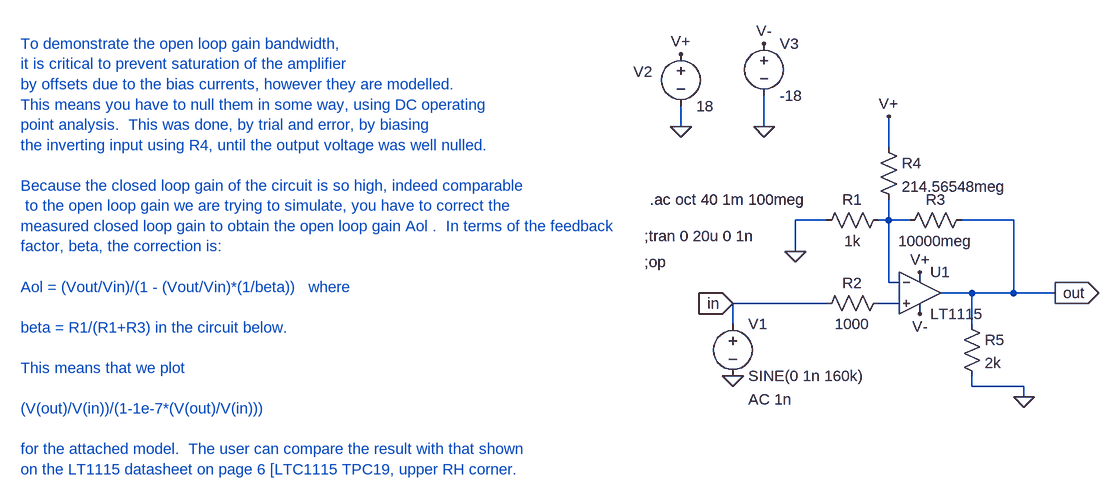
[diagram p0: schematic LT1115 Aol Demonstrator.asc]
LT1115 Aol Demonstrator.asc, the LTspice schematic file:
Version 4
SHEET 1 880 680
WIRE -192 32 -192 0
WIRE -112 336 -112 304
WIRE -64 32 -64 -16
WIRE -16 224 -16 176
WIRE 32 176 -16 176
WIRE 32 304 -112 304
WIRE 128 64 128 16
WIRE 128 176 112 176
WIRE 128 176 128 144
WIRE 128 272 128 176
WIRE 144 272 128 272
WIRE 144 304 112 304
WIRE 160 176 128 176
WIRE 256 288 208 288
WIRE 256 336 256 288
WIRE 256 432 256 416
WIRE 320 176 240 176
WIRE 320 288 256 288
WIRE 320 288 320 176
WIRE 336 432 256 432
WIRE 336 448 336 432
WIRE 384 288 320 288
FLAG -192 32 0
FLAG -64 32 0
FLAG -112 416 0
FLAG -192 -80 V+
FLAG -64 -96 V-
FLAG 384 288 out
IOPIN 384 288 Out
FLAG -112 304 in
IOPIN -112 304 In
FLAG -16 224 0
FLAG 176 256 V+
FLAG 176 320 V-
FLAG 128 16 V+
FLAG 336 448 0
SYMBOL voltage -112 320 R0
WINDOW 123 24 132 Left 0
WINDOW 39 0 0 Left 0
SYMATTR Value2 AC 1n
SYMATTR InstName V1
SYMATTR Value SINE(0 1n 160k)
SYMBOL voltage -192 -96 R0
WINDOW 123 0 0 Left 0
WINDOW 39 0 0 Left 0
WINDOW 0 -73 43 Left 0
SYMATTR InstName V2
SYMATTR Value 18
SYMBOL voltage -64 -112 R0
WINDOW 123 0 0 Left 0
WINDOW 39 0 0 Left 0
SYMATTR InstName V3
SYMATTR Value -18
SYMBOL Opamps\\LT1115 176 224 R0
SYMATTR InstName U1
SYMBOL res 128 160 R90
WINDOW 0 0 56 VBottom 0
WINDOW 3 32 56 VTop 0
SYMATTR InstName R1
SYMATTR Value 1k
SYMBOL res 128 288 R90
WINDOW 0 0 56 VBottom 0
WINDOW 3 32 56 VTop 0
SYMATTR InstName R2
SYMATTR Value 1000
SYMBOL res 256 160 R90
WINDOW 0 0 56 VBottom 0
WINDOW 3 32 56 VTop 0
SYMATTR InstName R3
SYMATTR Value 10000meg
SYMBOL res 112 48 R0
SYMATTR InstName R4
SYMATTR Value 214.56548meg
SYMBOL res 240 320 R0
SYMATTR InstName R5
SYMATTR Value 2k
TEXT -248 200 Left 0 !;tran 0 20u 0 1n
TEXT -240 144 Left 0 !.ac oct 40 1m 100meg
TEXT -248 240 Left 0 !;op
TEXT -1208 -96 Left 0 ;To demonstrate the open loop gain bandwidth, \nit is critical to prevent saturation of the amplifier\nby offsets due to the bias currents, however they are modelled.\nThis means you have to null them in some way, using DC operating\npoint analysis.  This was done, by trial and error, by biasing\nthe inverting input using R4, until the output voltage was well nulled.\n \nBecause the closed loop gain of the circuit is so high, indeed comparable\n to the open loop gain we are trying to simulate, you have to correct the\nmeasured closed loop gain to obtain the open loop gain Aol .  In terms of the feedback\nfactor, beta, the correction is:\n \nAol = (Vout/Vin)/(1 - (Vout/Vin)*(1/beta))   where   \n \nbeta = R1/(R1+R3) in the circuit below.\n \nThis means that we plot\n \n(V(out)/V(in))/(1-1e-7*(V(out)/V(in)))\n \nfor the attached model.  The user can compare the result with that shown\non the LT1115 datasheet on page 6 [LTC1115 TPC19, upper RH corner.

The netlist it stands for:
* LT1115 Aol Demonstrator.asc
V1 in 0 SINE(0 1n 160k) AC 1n
V2 V+ 0 18
V3 V- 0 -18
XU1 N002 N001 V+ V- out LT1028  ; LT1115, pins In+ In- V+ V- OUT
R1 N001 0 1k
R2 N002 in 1000
R3 out N001 10000meg
R4 V+ N001 214.56548meg
R5 out 0 2k
;tran 0 20u 0 1n
.ac oct 40 1m 100meg
;op
* To demonstrate the open loop gain bandwidth,
* it is critical to prevent saturation of the amplifier
* by offsets due to the bias currents, however they are modelled.
* This means you have to null them in some way, using DC operating
* point analysis.  This was done, by trial and error, by biasing
* the inverting input using R4, until the output voltage was well nulled.
* Because the closed loop gain of the circuit is so high, indeed comparable
*  to the open loop gain we are trying to simulate, you have to correct the
* measured closed loop gain to obtain the open loop gain Aol .  In terms of the feedback
* factor, beta, the correction is:
* Aol = (Vout/Vin)/(1 - (Vout/Vin)*(1/beta))   where
* beta = R1/(R1+R3) in the circuit below.
* This means that we plot
* (V(out)/V(in))/(1-1e-7*(V(out)/V(in)))
* for the attached model.  The user can compare the result with that shown
* on the LT1115 datasheet on page 6 [LTC1115 TPC19, upper RH corner.
.lib LTC.lib
.backanno
.end